# EAGLE design RAK3272 (EAGLE 7.7.0)
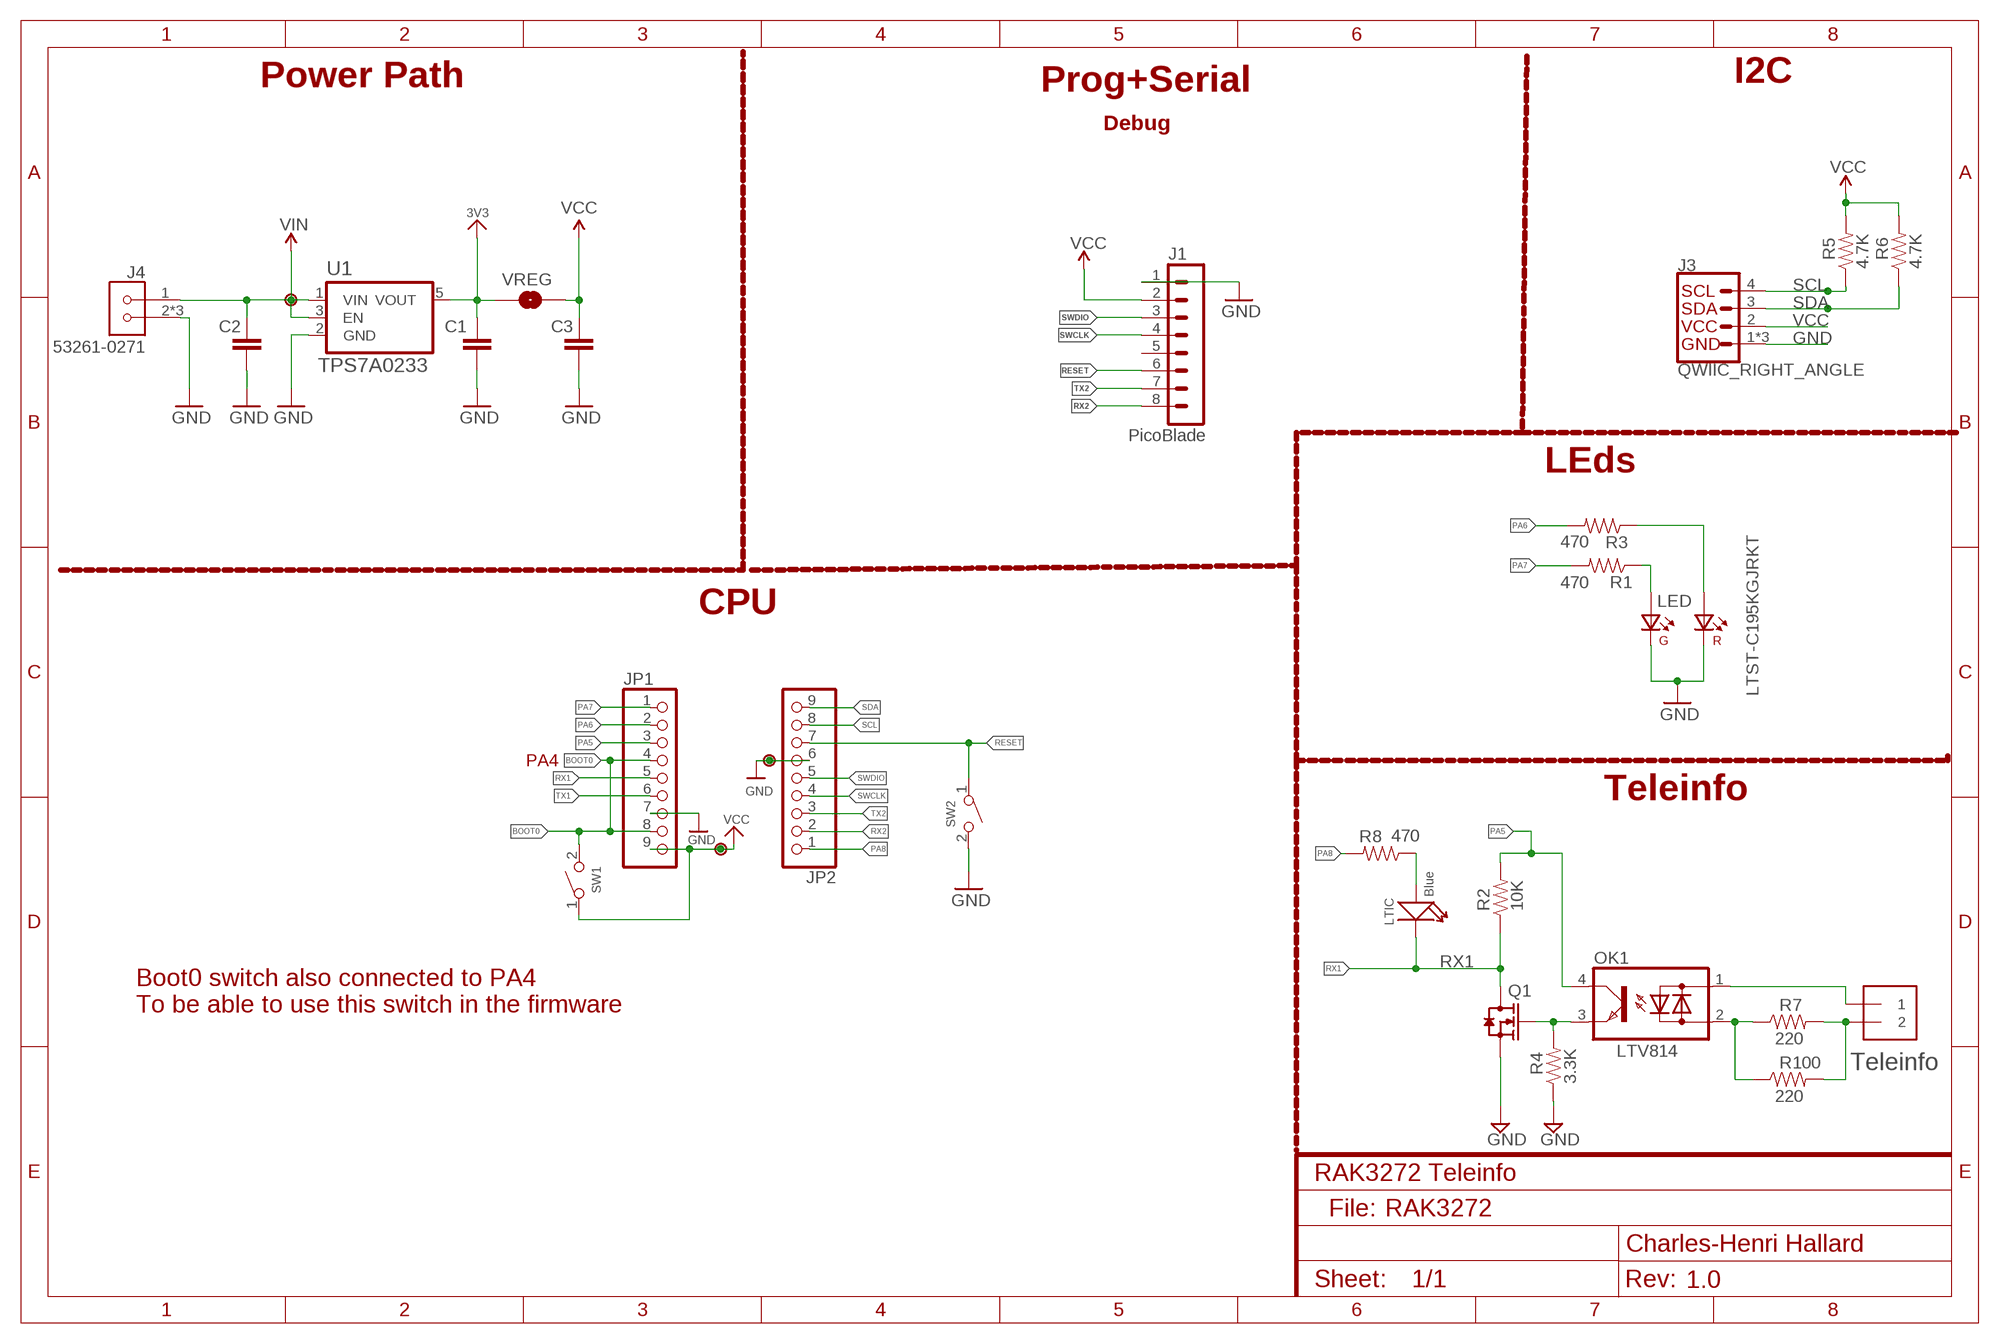
[diagram p0: schematic, sheet 1]
NAME (FRAME-A4L): CNAME: RAK3272 Teleinfo; CREVISION: 1.0; DESIGNER: Charles-Henri Hallard

## Parts
C1  1.0uF  CAP0402-CAP-OK  [0402-CAP-OK]
C2  1.0uF  CAP0402-CAP-OK  [0402-CAP-OK]
C3  1.0uF  CAP0402-CAP-OK  [0402-CAP-OK]
J1  PicoBlade  53047-0810  [53047-0810]
J2  1X2-3.5MM  [1X2-3.5MM]
J3  QWIIC_RIGHT_ANGLE  QWIIC_CONNECTOR_IICHORIZONTAL  [JST04_1MM_HORI]
J4  53261-0271  [MOLEX_53261-0271]
JP1  PINHD-1X9  [1X09-BIG]
JP2  PINHD-1X9  [1X09-BIG]
LED  LTST-C195KGJRKT  [LTST-BILED-15X16]
LTIC  Blue  SMD-LED-CLEAR-BLUE(0402)  [LED-0402]
OK1  LTV814  SFH6206  [DIL4-SMD]
P1  PADNORMAL  [PAD]
P2  PADNORMAL  [PAD]
P3  PADNORMAL  [PAD]
Q1  CJ2302  SMD-MOSFET-N-CH-20V-2.1A-CJ2302(SOT-23)  [SOT-323-3]
R1  470  RESISTOR0402-RES  [0402-RES]
R2  10K  RESISTOR0402-RES  [0402-RES]
R3  470  RESISTOR0402-RES  [0402-RES]
R4  3.3K  RESISTOR0402-RES  [0402-RES]
R5  4.7K  RESISTOR0402-RES  [0402-RES]
R6  4.7K  RESISTOR0402-RES  [0402-RES]
R7  220  RESISTOR0402-RES  [0402-RES]
R8  470  RESISTOR0402-RES  [0402-RES]
R100  220  RESISTOR1206  [1206]
SW1  B3U-1000P-2P-SMD  SMD-BUTTON(2P-3.0X2.5X1.2+0.4MM)  [C498294]
SW2  B3U-1000P-2P-SMD  SMD-BUTTON(2P-3.0X2.5X1.2+0.4MM)  [C498294]
U1  TPS7A0233  TPS7A0233PDBVR  [SOT95P280X145-5N]
VREG  JUMPER-SMT_2_NO_NO-SILK  [SMT-JUMPER_2_NO_NO-SILK]

## Nets
3V3: C1.1 U1.5(VOUT) VREG.2
BOOT0: JP1.4 JP1.8 SW1.2
GND: C1.2 C2.2 C3.2 J1.1 J3.1 J3.NC1 J3.NC2 J4.2 J4.P1 J4.P2 JP1.7 JP2.6 LED.P$3(K1) LED.P$4(K2) P2.1 Q1.2(S) R4.1 SW2.2 U1.2(GND)
N$1: LED.P$2(A2) R3.1
N$2: LED.P$1(A1) R1.1
N$11: OK1.2(AC2) R7.1 R100.1
N$12: J2.1 OK1.1(AC1)
N$13: J2.2 R7.2 R100.2
N$16 [power]: OK1.3(E) Q1.1(G) R4.2
N$19: LTIC.+ R8.1
PA5: JP1.3 OK1.4(C) R2.2
PA6: JP1.2 R3.2
PA7: JP1.1 R1.2
PA8: JP2.1 R8.2
RESET: J1.6 JP2.7 SW2.1
RX1: JP1.5 LTIC.- Q1.3(D) R2.1
RX2: J1.8 JP2.2
SCL: J3.4 JP2.8 R5.1
SDA: J3.3 JP2.9 R6.1
SWCLK: J1.4 JP2.4
SWDIO: J1.3 JP2.5
TX1: JP1.6
TX2: J1.7 JP2.3
VCC: C3.1 J1.2 J3.2 JP1.9 P3.1 R5.2 R6.2 SW1.1 VREG.1
VIN: C2.1 J4.1 P1.1 U1.1(VIN) U1.3(EN)
Unconnected: J1.5

## Notes on the sheet
- I2C
- Power Path | Prog+Serial
- Debug
- LEds
- CPU
- PA4
- Teleinfo
- Boot0 switch also connected to PA4
  To be able to use this switch in the firmware
- Teleinfo
- File:

## Library data of the parts
C1-C3 = _c2h:CAP: Capacitor Standard 0603 ceramic capacitor, and 0.1" leaded capacitor.
J1 = con-molex-picoblade:53047-0810: HEADER
J2 = _c2h:1X2: 3.5mm Terminal block http://www.ladyada.net/library/pcb/eaglelibrary.html
J3 = _c2h:QWIIC_CONNECTOR_IIC: SparkFun I2C Standard Qwiic Connector An SMD 1mm pitch JST connector makes it easy and quick (get it? Qwiic?) to connect I2C devices to each other. The Qwiic system <http://www.sparkfun.com/qwiic> enables fast and solderless connection between popular platforms and various sensors and actuators. We carry 200mm <https://www.sparkfun.com/products/14204>, 100mm <https://www.sparkfun.com/products/14205>, 50mm <https://www.sparkfun.com/products/14206>, and breadboard friendly <https://www.sparkfun.com/products/14207> Qwiic cables. We also offer 10 pcs strips <https://www.sparkfun.com/products/14323> the SMD connectors.; PROD_ID: CONN-13694
J4 = _c2h:53261-0271: Conn Shrouded Header HDR 2 POS 1.25mm Solder RA SMD PicoBlade™ Embossed T/R Check availability <https://pricing.snapeda.com/parts/53261-0271/Molex/view-part?ref=eda>; AVAILABILITY: In Stock; DESCRIPTION: Connector Header Surface Mount, Right Angle 2 position 0.049 (1.25mm); MF: Molex; MP: 53261-0271; PACKAGE: None; PRICE: None; PURCHASE-URL: https://pricing.snapeda.com/search/part/53261-0271/?ref=eda
JP1 JP2 = adafruit:PINHD-1X9: Pin header 1x10 0.1" spacing With round pins
LED = LTST-C195KGJRKT:LTST-C195KGJRKT: Check availability <https://pricing.snapeda.com/parts/LTST-C195KGJRKT/Lite-On%20Inc./view-part?ref=eda>; AVAILABILITY: In Stock; DESCRIPTION: Green, Red 571nm Green, 631nm Red LED Indication - Discrete 2V Green, 2V Red 0606 (1616 Metric); MF: Lite-On Inc.; MP: LTST-C195KGJRKT; PACKAGE: None; PRICE: None; PURCHASE-URL: https://pricing.snapeda.com/search/part/LTST-C195KGJRKT/?ref=eda
LTIC = OPL_Optoelectronics:SMD-LED-CLEAR-BLUE(0402): 304090075; MPN: BL-HB337A-AV-TRB; VALUE: BLUE-0402
OK1 = optocoupler:SFH620: Optocoupler, Phototransistor Output, AC Input Source: http://www.vishay.com/docs/83675/sfh620.pdf; MF: VISHAY/TELEFUNKEN; MPN: SFH6206-3; OC_FARNELL: 1469585; OC_NEWARK: 58K2214
P1-P3 = _c2h:PAD
Q1 = _c2h:SMD-MOSFET-N-CH-20V-2.1A-CJ2302(SOT-23): 305030015
R1-R4 R8 = LowPowerLab:RESISTOR: Resistor Basic schematic elements and footprints for 0603, 1206, and PTH resistors.
R5-R7 R100 = _c2h:RESISTOR: Resistor Basic schematic elements and footprints for 0603, 1206, and PTH resistors.
SW1 SW2 = _c2h:SMD-BUTTON(2P-3.0X2.5X1.2+0.4MM): 311020047
U1 = TPS7A0233PDBVR:TPS7A0233PDBVR: Check availability <https://pricing.snapeda.com/parts/TPS7A0233PDBVR/Texas%20Instruments/view-part?ref=eda>; AVAILABILITY: In Stock; DESCRIPTION: 200-mA, nanopower-IQ (25 nA), low-dropout (LDO) voltage regulator with enable; MF: Texas Instruments; MP: TPS7A0233PDBVR; PACKAGE: SOT-23-5 Texas Instruments; PRICE: None; PURCHASE-URL: https://pricing.snapeda.com/search/part/TPS7A0233PDBVR/?ref=eda
VREG = SparkFun-Jumpers:JUMPER-SMT_2_NO: Normally open jumper This jumper has two pads in close proximity to each other. Apply solder to close the connection. Round pads are easier to solder for beginners, but are a lot larger. SparkFun Product that uses the round pads: SparkFun EL Sequencer <https://www.sparkfun.com/products/12781>

## Net classes
0 default: width 0.203 mm, drill 0.254 mm, clearance 0.152 mm
1 power: width 0.203 mm, clearance 0.152 mm

## Board
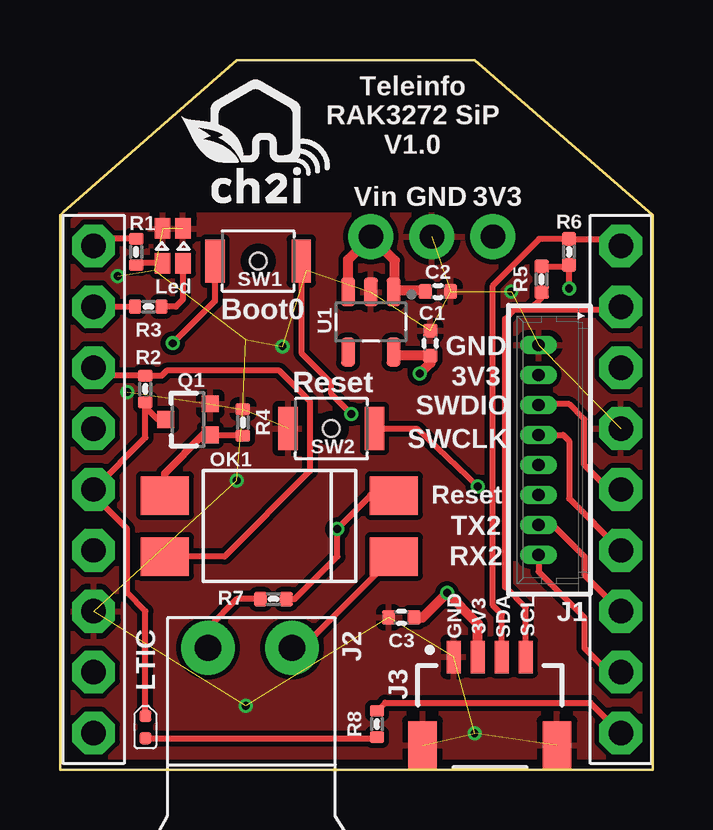
[diagram p1: board, top side]
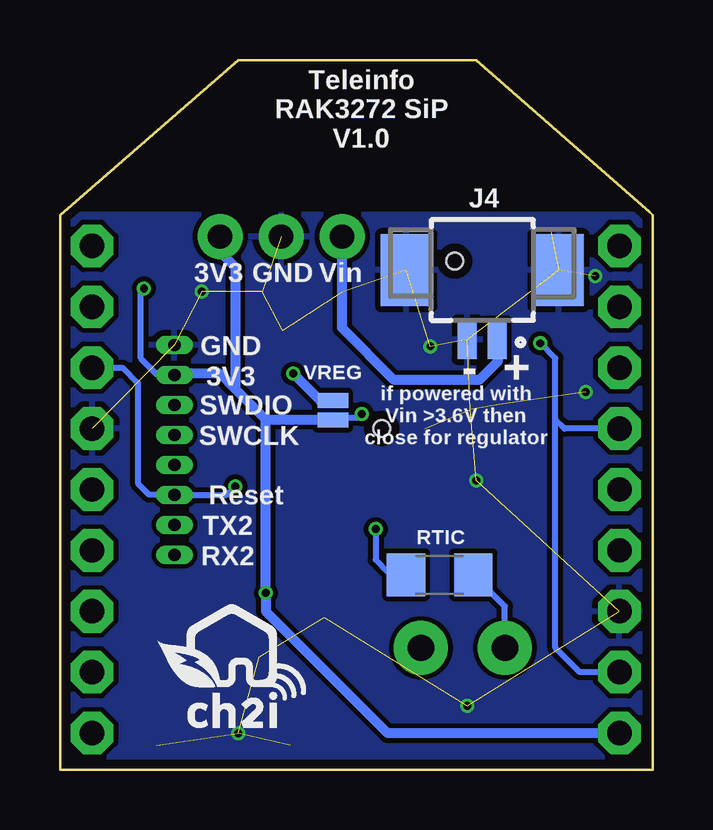
[diagram p2: board, bottom side, seen from below]

Size 24.71 x 29.59 mm. Coordinates in mm from the lower left corner, seen from the top.
Outline: 0.13,23.24 7.37,29.59 17.27,29.59 24.71,23.11 24.71,0 0,0 0,23.11 0.13,23.24
Copper layers (1*16): Top 0.035559375mm / dielectric 1.6mm / Bottom 0.035559375mm
Design rules "oshpark-2layer *": minimum track width 6mil, minimum drill 10mil, track to track 6mil, track to pad 6mil, pad to pad 6mil, via to via 6mil, smd to smd 6mil, copper to edge 15mil, drill to drill 6mil, minimum pad ring 5mil, minimum via ring 5mil, stop-mask expansion 2.5mil, vias tented up to drill 30mil, thermal gap 10mil

### Footprints (pad centres in the part's own frame; a part is rotated, then mirrored left to right if it is on the bottom)
0402-CAP-OK = smd 0.56 x 0.6: 1 -0.521,0; 2 0.525,0
53047-0810 = drill 0.508 long: 1 4.375,0; 2 3.125,0; 3 1.875,0; 4 0.625,0; 5 -0.625,0; 6 -1.875,0; 7 -3.125,0; 8 -4.375,0
1X2-3.5MM = drill 1.1 pad 2.235: 1 1.8,0; 2 -1.7,0
JST04_1MM_HORI = smd 0.6 x 1.35: 1 1.5,-2.54; 2 0.5,-2.54; 3 -0.5,-2.54; 4 -1.5,-2.54 | smd 1.2 x 2: NC1 -2.8,1.135; NC2 2.8,1.135
MOLEX_53261-0271 = smd 0.8 x 1.6: 1 -0.625,2.9; 2 0.625,2.9 | smd 2.1 x 3: P1 -3.175,0; P2 3.175,0
1X09-BIG = drill 1.016 pad 1.778 octagon: 1 -10.16,0; 2 -7.62,0; 3 -5.08,0; 4 -2.54,0; 5 0,0; 6 2.54,0; 7 5.08,0; 8 7.62,0; 9 10.16,0
LTST-BILED-15X16 = smd 0.65 x 0.85: P$1 0.425,0.725; P$2 -0.425,0.725; P$3 0.425,-0.725; P$4 -0.425,-0.725
LED-0402 = smd 0.5 x 0.5: + -0.463,0; - 0.463,0
DIL4-SMD = smd 1.6 x 2: 1 -1.27,-4.77; 2 1.27,-4.77; 3 1.27,4.77; 4 -1.27,4.77
PAD = drill 1.016 pad 1.88: 1 0,0
SOT-323-3 = smd 0.7 x 0.7: 1 -0.65,-0.925; 2 0.65,-0.925; 3 0,0.925
0402-RES = smd 0.5 x 0.6: 1 -0.55,0; 2 0.55,0
0402-RES' = smd 0.56 x 0.6: 1 -0.534,0; 2 0.534,0
1206 = smd 1.6 x 1.8: 1 -1.4,0; 2 1.4,0
C498294 = smd 0.8 x 1.8: 1 -1.8,0; 2 1.8,0 | hole 0.69: 0,0
SOT95P280X145-5N = smd 1.21 x 0.59: 1 -1.255,0.95; 2 -1.255,0; 3 -1.255,-0.95; 4 1.255,-0.95; 5 1.255,0.95
SMT-JUMPER_2_NO_NO-SILK = smd 0.635 x 1.27: 1 -0.406,0; 2 0.406,0

### Placement (x,y rotation side)
$$U$1  [LOGO_C2I_015]  5.06,23.59 0 top
C1  15.43,17.78 90 top
C2  15.75,19.94 0 top
C3  14.22,6.35 180 top
J1  19.94,13.33 90 top
J2  7.87,5.08 0 top
J3  17.91,2.16 180 top
J4  7.11,20.83 180 bottom
JP1  1.4,11.68 270 top
JP2  23.37,11.68 90 top
LED  4.7,21.84 180 top
LTIC  3.56,1.78 90 top
OK1  9.14,10.16 90 top
P1  12.95,22.22 0 top
P2  15.49,22.22 0 top
P3  18.03,22.22 0 top
Q1  5.33,14.61 90 top
R1  3.17,21.59 90 top
R2  3.56,15.88 90 top
R3  3.68,19.3 180 top
R4  7.62,14.48 270 top
R5  4.7K  [0402-RES']  20.07,20.45 90 top
R6  4.7K  [0402-RES']  21.21,21.59 270 top
R7  220  [0402-RES']  8.89,7.11 180 top
R8  13.21,1.91 90 top
R100  8.89,8.13 0 bottom
SW1  8.26,21.21 180 top
SW2  11.3,14.22 180 top
U1  12.95,18.67 270 top
U$100  [LOGO_C2I_015]  20.64,1.71 0 bottom
VREG  13.33,14.99 90 bottom

### Tracks (layer width: path | path; a pad name or v marks a point on that pad's centre or on a via)
3V3  (via drill 0.33)
  Top 0.406: 15.49,17.32 C1.1 | v14.99,16.51 15.43,16.95 C1.1 | C1.1 14.06,17.26 U1.5
  Bottom 0.406: VREG.2 13.87,15.39 v14.99,16.51
BOOT0  (via drill 0.33)
  Top 0.254: SW1.2 6.46,19.54 v4.7,17.78
  Bottom 0.254: JP1.8 3.05,4.06 4.06,5.08 4.06,14.61 | 4.06,14.61 4.06,17.14 v4.7,17.78 | JP1.4 3.68,14.22 4.06,14.61
GND  (via drill 0.33)  (25 unrouted)
  other vias: 2.79,15.75 18.8,19.94 17.27,1.52 9.27,17.65 7.75,2.67 7.37,12.06 2.41,20.57
  pour Bottom (isolate 0.203): 26.16,23.11 26.29,-1.27 -1.65,-1.27 -1.78,23.11
  pour Top (isolate 0.203): -1.14,23.11 25.53,23.11 25.65,-0.63 -1.02,-0.63
N$1
  Top 0.254: LED.P$2 5.12,19.6 4.83,19.3 R3.1
N$2
  Top 0.254: LED.P$1 3.35,21.12 R1.1
N$11  (via drill 0.33)
  Top 0.254: R7.1 9.78,7.11 11.56,8.89 v11.56,10.03 12.95,11.43
  Top 0.305: OK1.2 12.95,11.43
  Bottom 0.254: v11.56,10.03 11.56,8.76 11.05,8.25 10.42,8.25 R100.1
N$12
  Top 0.254: J2.1 10.1,5.08 OK1.1
N$13
  Top 0.254: R7.2 7.37,7.11 6.17,5.92 J2.2
  Bottom 0.254: J2.2 6.17,6.81 R100.2
N$16
  Top 0.254: Q1.1 7.59,13.95 R4.2
  Top 0.305: OK1.3 4.36,11.41 4.36,12.36 5.97,13.97 Q1.1
N$19
  Top 0.254: LTIC.+ 13.17,1.32 R8.1
PA5
  Top 0.254: OK1.4 6.86,8.89 10.41,12.45 10.41,15.37 9.14,16.64 4.45,16.64 4.23,16.43 R2.2 1.74,16.43 JP1.3
PA6
  Top 0.254: JP1.2 R3.2
PA7
  Top 0.254: R1.2 1.69,22.14 JP1.1
PA8
  Top 0.254: JP2.1 22.1,2.79 13.55,2.79 R8.2
RESET  (via drill 0.33)
  Top 0.254: SW2.1 14.86,14.22 v17.4,11.81
  Bottom 0.254: JP2.7 22.1,16.76 21.46,16.13 21.46,11.94 20.98,11.46 J1.6 17.75,11.46 v17.4,11.81
RX1
  Top 0.254: 4.41,14.44 Q1.3 4.06,14.61 3.56,15.11 R2.1 3.56,13.84 JP1.5 1.4,11.43 2.79,10.03 2.79,7.37 3.56,6.6 LTIC.-
RX2
  Top 0.254: J1.8 19.94,8.25 21.84,6.35 21.84,5.08 22.86,4.06 JP2.2
SCL
  Top 0.254: 19.56,19.18 18.92,19.18 18.54,18.8 18.54,7.62 19.41,6.75 J3.4 | 19.56,19.18 23.24,19.18 JP2.8 | R5.1 20.07,19.68 19.56,19.18
SDA
  Top 0.254: JP2.9 23.09,22.12 R6.1 19.96,22.12 18.03,20.19 18.03,6.86 18.41,6.49 J3.3
SWCLK
  Top 0.254: J1.4 20.96,13.96 21.21,13.72 21.21,11.3 JP2.4
SWDIO
  Top 0.254: JP2.5 22.86,11.68 21.84,12.7 21.84,14.61 21.21,15.24 19.97,15.24 J1.3
TX2
  Top 0.254: JP2.3 21.84,8.13 21.84,8.89 20.52,10.21 J1.7
VCC  (via drill 0.33)
  Top 0.254: R5.2 21.13,20.98 R6.2 v21.21,20.07 | SW1.1 10.05,17.38 11.3,16.13 11.3,15.66 v12.13,14.83
  Top 0.406: J3.2 17.41,6.09 v16.13,7.37 15.11,6.35 C3.1
  Bottom 0.254: J1.2 20.65,16.46 21.34,17.14 21.34,19.94 v21.21,20.07 | v12.13,14.83 12.16,14.83 12.33,14.67 13.25,14.67 VREG.1
  Bottom 0.406: JP1.9 11.05,1.52 16.13,6.6 v16.13,7.37 16.13,14.61 | 17.4,15.88 18.03,16.51 19.89,16.51 J1.2 | P3.1 18.03,21.59 17.4,20.95 17.4,15.88 | 17.4,15.88 16.13,14.61 | 16.13,14.61 13.44,14.61 VREG.1
VIN
  Top 0.406: C2.1 15.1,19.97 13.95,19.97 | 13.95,19.97 U1.1 | 13.95,19.97 13.95,21.23 P1.1 12,21.27 U1.3
  Bottom 0.406: J4.1 6.48,17.81 6.48,17.02 7.24,16.26 10.79,16.26 12.95,18.41 P1.1

### Text on the board
tPlace: Teleinfo / RAK3272 SiP / V1.0
bPlace: Teleinfo / RAK3272 SiP / V1.0
tNames: Vin | GND | 3V3 | Led | Boot0 | GND | Reset | 3V3 | SWDIO | SWCLK | Reset | TX2 | RX2 | GND | 3V3 | SDA | SCL
bNames: Vin | GND | 3V3 | GND | + | - | 3V3 | SWDIO | if powered with / Vin >3.6V then / close for regulator | SWCLK | Reset | TX2 | RTIC | RX2